# EAGLE schematic BMS Rev. 1 (EAGLE 7.6.0)
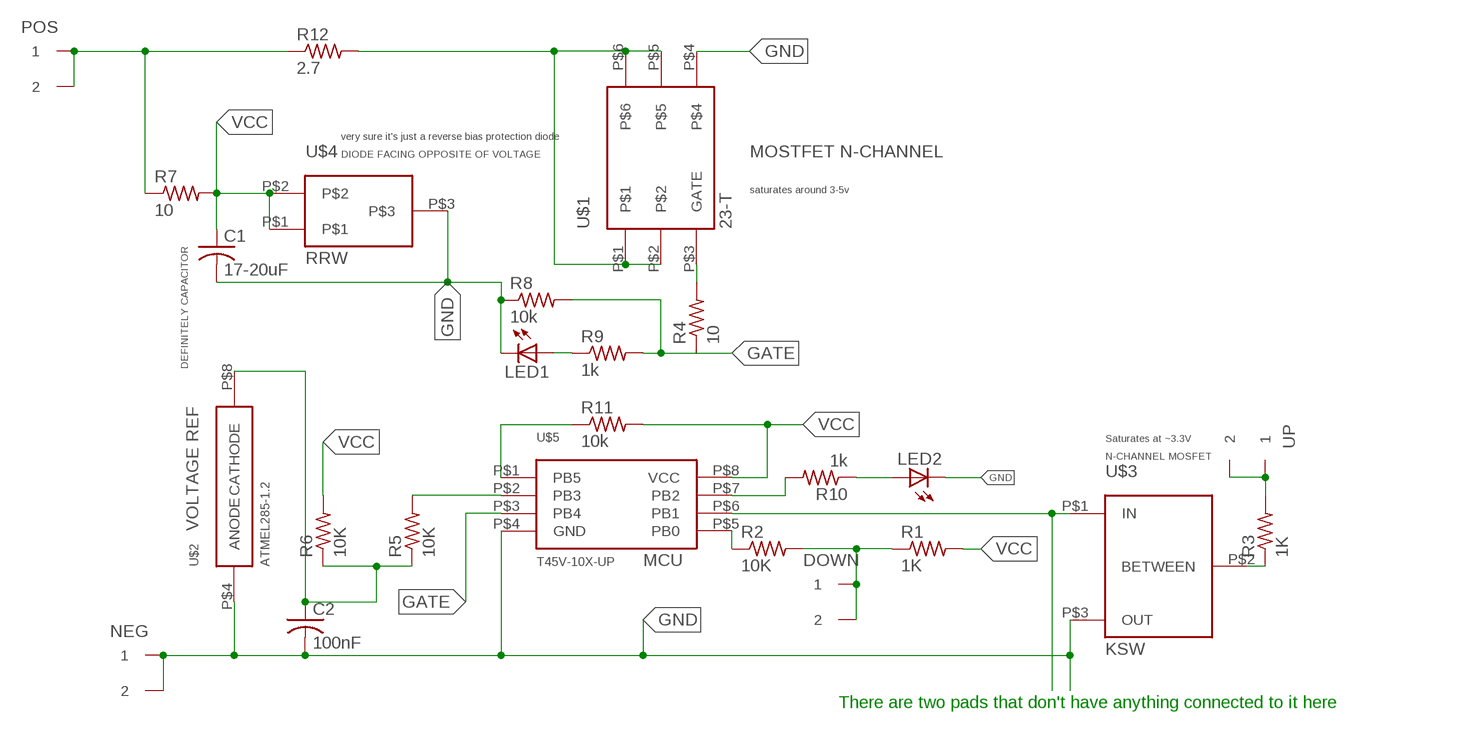
[diagram p0: schematic, sheet 1]

## Parts
C1  17-20uF  C-USC0805  [C0805]
C2  100nF  C-USC0805  [C0805]
DOWN  CONN_1  [CONNECTOR_1]
LED1  LEDCHIPLED_1206  [CHIPLED_1206]
LED2  LEDCHIPLED_1206  [CHIPLED_1206]
NEG  CONN_1  [CONNECTOR_1]
POS  CONN_1  [CONNECTOR_1]
R1  1K  R-US_R0805  [R0805]
R2  10K  R-US_R0805  [R0805]
R3  1K  R-US_R0805  [R0805]
R4  10  R-US_R0805  [R0805]
R5  10K  R-US_R0805  [R0805]
R6  10K  R-US_R0805  [R0805]
R7  10  R-US_R0805  [R0805]
R8  10k  R-US_R0805  [R0805]
R9  1k  R-US_R0805  [R0805]
R10  1k  R-US_R0805  [R0805]
R11  10k  R-US_R0805  [R0805]
R12  2.7  R-US_R0805  [R0805]
U$1  23-T  [SOT-23-6]
U$2  ATMEL285-1.2  [8-SOIC]
U$3  KSW  [SOT23-3]
U$4  RRW  [SOT23-3]
U$5  T45V-10X-UP  [TSOP-8]
UP  CONN_1  [CONNECTOR_1]

## Nets
DOWN: DOWN.1 DOWN.2 R1.1 R2.2
GATE: R4.1 R8.2 R9.2 U$5.P$3(PB4)
GND: C1.2 C2.2 LED1.C LED2.C NEG.1 NEG.2 R8.1 U$1.P$4 U$2.P$4(ANODE) U$3.P$3(OUT) U$4.P$3 U$5.P$4(GND)
N$1: C2.1 R5.1 R6.1 U$2.P$8(CATHODE)
N$2: R10.2 U$5.P$7(PB2)
N$3: R4.2 U$1.P$3(GATE)
N$4: R3.1 U$3.P$2(BETWEEN)
N$5: R11.1 U$5.P$1(PB5)
N$6: R2.1 U$5.P$5(PB0)
N$7: R5.2 U$5.P$2(PB3)
N$8: LED2.A R10.1
N$9: R12.2 U$1.P$1 U$1.P$2 U$1.P$5 U$1.P$6
N$11: LED1.A R9.1
N$15: U$3.P$1(IN) U$5.P$6(PB1)
POS: POS.1 POS.2 R7.1 R12.1
UP: R3.2 UP.1 UP.2
VCC: C1.1 R1.2 R6.2 R7.2 R11.2 U$4.P$1 U$4.P$2 U$5.P$8(VCC)

## Notes on the sheet
- very sure it's just a reverse bias protection diode
- DIODE FACING OPPOSITE OF VOLTAGE | MOSTFET N-CHANNEL
- saturates around 3-5v
- DEFINITELY CAPACITOR
- Saturates at ~3.3V
- N-CHANNEL MOSFET
- VOLTAGE REF
- MCU
- There are two pads that don't have anything connected to it here

## Library data of the parts
C1 C2 = resistor:C-US: CAPACITOR, American symbol
DOWN NEG POS UP = formula electric:CONN_1
LED1 LED2 = led:LED: LED OSRAM: - CHIPLED LG R971, LG N971, LY N971, LG Q971, LY Q971, LO R971, LY R971 LH N974, LH R974 LS Q976, LO Q976, LY Q976 LO Q996 - Hyper CHIPLED LW Q18S LB Q993, LB Q99A, LB R99A - SideLED LS A670, LO A670, LY A670, LG A670, LP A670 LB A673, LV A673, LT A673, LW A673 LH A674 LY A675 LS A676, LA A676, LO A676, LY A676, LW A676 LS A679, LY A679, LG A679 - Hyper Micro SIDELED® LS Y876, LA Y876, LO Y876, LY Y876 LT Y87S - SmartLED LW L88C, LW L88S LB L89C, LB L89S, LG L890 LS L89K, LO L89K, LY L89K LS L896, LA L896, LO L896, LY L896 - TOPLED LS T670, LO T670, LY T670, LG T670, LP T670 LSG T670, LSP T670, LSY T670, LOP T670, LYG T670 LG T671, LOG T671, LSG T671 LB T673, LV T673, LT T673, LW T673 LH T674 LS T676, LA T676, LO T676, LY T676, LB T676, LH T676, LSB T676, LW T676 LB T67C, LV T67C, LT T67C, LS T67K, LO T67K, LY T67K, LW E67C LS E67B, LA E67B, LO E67B, LY E67B, LB E67C, LV E67C, LT E67C LW T67C LS T679, LY T679, LG T679 LS T770, LO T770, LY T770, LG T770, LP T770 LB T773, LV T773, LT T773, LW T773 LH T774 LS E675, LA E675, LY E675, LS T675 LS T776, LA T776, LO T776, LY T776, LB T776 LHGB T686 LT T68C, LB T68C - Hyper Mini TOPLED® LB M676 - Mini TOPLED Santana® LG M470 LS M47K, LO M47K, LY M47K Source: http://www.osram.convergy.de LUXEON: - LUMILED® LXK2-PW12-R00, LXK2-PW12-S00, LXK2-PW14-U00, LXK2-PW14-V00 LXK2-PM12-R00, LXK2-PM12-S00, LXK2-PM14-U00 LXK2-PE12-Q00, LXK2-PE12-R00, LXK2-PE12-S00, LXK2-PE14-T00, LXK2-PE14-U00 LXK2-PB12-K00, LXK2-PB12-L00, LXK2-PB12-M00, LXK2-PB14-N00, LXK2-PB14-P00, LXK2-PB14-Q00 LXK2-PR12-L00, LXK2-PR12-M00, LXK2-PR14-Q00, LXK2-PR14-R00 LXK2-PD12-Q00, LXK2-PD12-R00, LXK2-PD12-S00 LXK2-PH12-R00, LXK2-PH12-S00 LXK2-PL12-P00, LXK2-PL12-Q00, LXK2-PL12-R00 Source: www.luxeon.com KINGBRIGHT: KA-3528ASYC Source: www.kingbright.com
R1-R12 = resistor:R-US_: RESISTOR, American symbol
U$1 = BMS Lbr:23-T: A Transistor or switch of some sort.; OC_NEWARK: unknown
U$2 = BMS Lbr:ATMEL285-1.2: LM285-1.2 IC This is a 1.235 volt reference IC. Other ICs can be used that are of different package sizes; OC_NEWARK: unknown
U$3 = BMS Lbr:KSW: May be a temperature sensing IC; OC_NEWARK: unknown
U$4 = BMS Lbr:RRW; OC_NEWARK: unknown
U$5 = BMS Lbr:T45V-10X-UP: Suspected to be the ATtiny45V microcontroller based off of pinout and connection to programming pins; OC_NEWARK: unknown